# Altium schematic sheet 09 Ethernet.SchDoc: Ethernet
size 420 x 297 mm; SheetNumber: 9; SheetTotal: 11
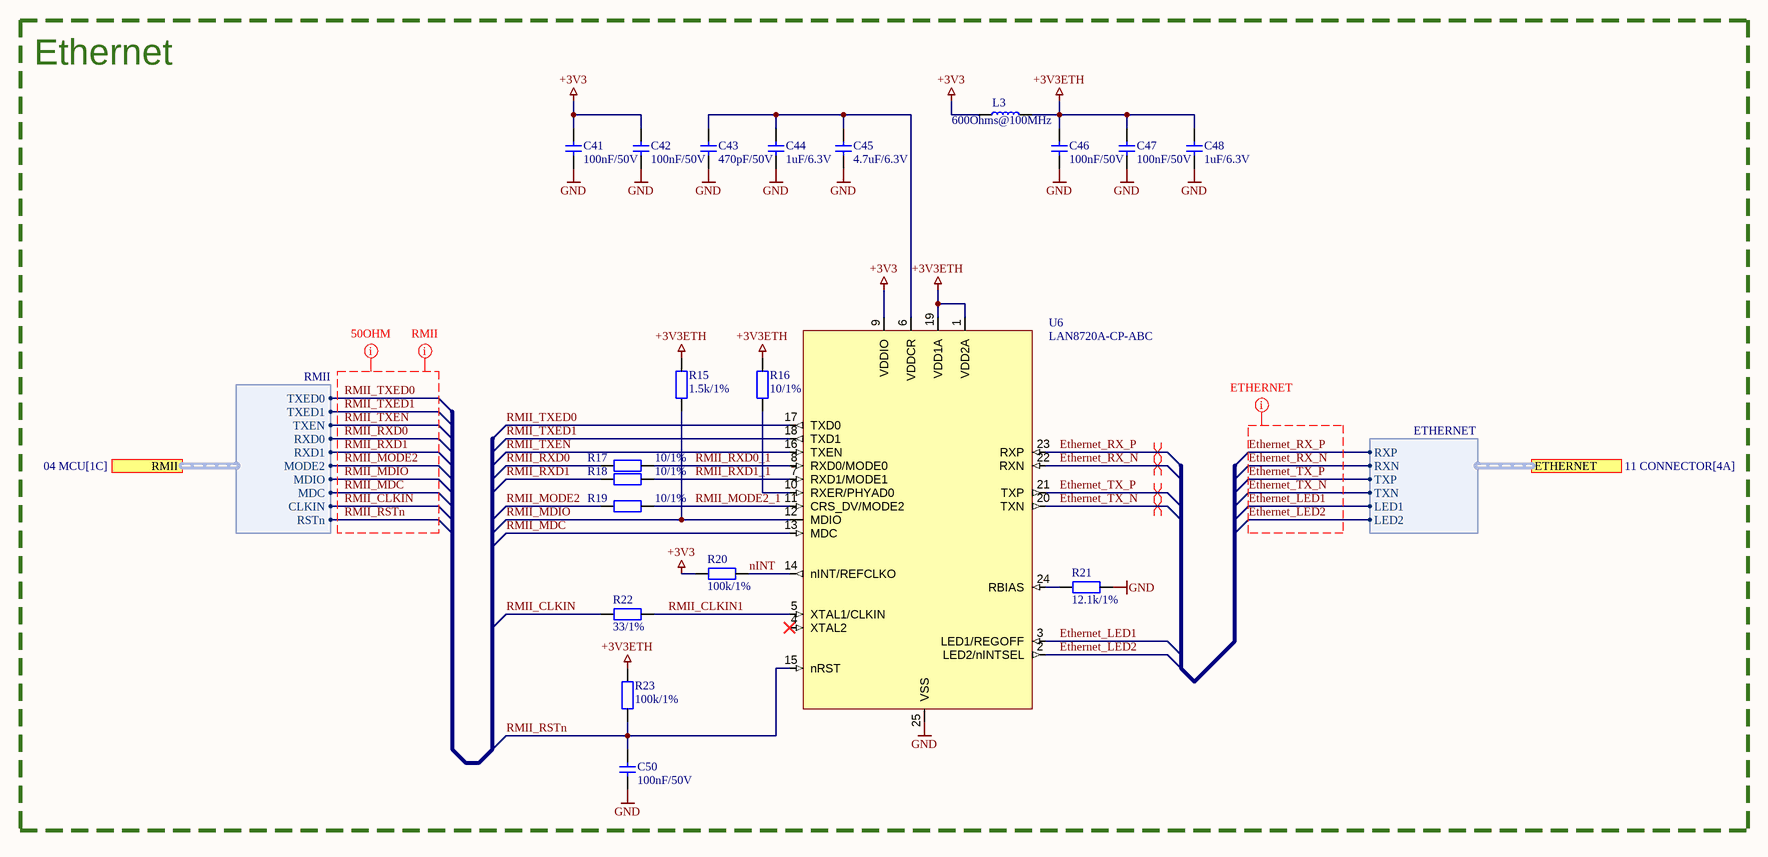
[diagram p0: 09 Ethernet.SchDoc]

## Parts
C41  100nF/50V  [CAPC1005X06M-0402]
C42  100nF/50V  [CAPC1005X06M-0402]
C43  470pF/50V  [CAPC1005X06M-0402]
C44  1uF/6.3V  [CAPC1005X06M-0402]
C45  4.7uF/6.3V  [CAPC1005X06M-0402]
C46  100nF/50V  [CAPC1005X06M-0402]
C47  100nF/50V  [CAPC1005X06M-0402]
C48  1uF/6.3V  [CAPC1005X06M-0402]
C50  100nF/50V  [CAPC1005X06M-0402]
L3  600Ohms@100MHz  [INDC1005X06M-0402]
R15  1.5k/1%  [RESC1005X04M-0402]
R16  10/1%  [RESC1005X04M-0402]
R17  10/1%  [RESC1005X04M-0402]
R18  10/1%  [RESC1005X04M-0402]
R19  10/1%  [RESC1005X04M-0402]
R20  100k/1%  [RESC1005X04M-0402]
R21  12.1k/1%  [RESC1005X04M-0402]
R22  33/1%  [RESC1005X04M-0402]
R23  100k/1%  [RESC1005X04M-0402]
U6  LAN8720A-CP-ABC  [QFN24P50_40X40X85L40X25]

## Blocks framed on the sheet
Ethernet: C41-C48 C50 L3 R15-R23 U6

## Ports
ETHERNET (harness ETHERNET, see 11 CONNECTOR[4A]), RMII (harness RMII, see 04 MCU[1C])

## Harnesses
ETHERNET: RXP, RXN, TXP, TXN, LED1, LED2
RMII: TXED0, TXED1, TXEN, RXD0, RXD1, MODE2, MDIO, MDC, CLKIN, RSTn

## Nets
+3V3: C41.2 C42.2 L3.1 R20.1 U6.9(VDDIO)
+3V3ETH: C46.2 C47.2 C48.2 L3.2 R15.2 R16.2 R23.1 U6.1(VDD2A) U6.19(VDD1A)
GND: C41.1 C42.1 C43.1 C44.1 C45.1 C46.1 C47.1 C48.1 C50.1 R21.2 U6.25(VSS)
Ethernet_LED1: U6.3(LED1/REGOFF) ; port ETHERNET.LED1
Ethernet_LED2: U6.2(LED2/nINTSEL) ; port ETHERNET.LED2
Ethernet_RX_N: U6.22(RXN) ; port ETHERNET.RXN
Ethernet_RX_P: U6.23(RXP) ; port ETHERNET.RXP
Ethernet_TX_N: U6.20(TXN) ; port ETHERNET.TXN
Ethernet_TX_P: U6.21(TXP) ; port ETHERNET.TXP
nINT: R20.2 U6.14(nINT/REFCLKO)
RMII_CLKIN: R22.1 ; port RMII.CLKIN
RMII_CLKIN1: R22.2 U6.5(XTAL1/CLKIN)
RMII_MDC: U6.13(MDC) ; port RMII.MDC
RMII_MDIO: R15.1 U6.12(MDIO) ; port RMII.MDIO
RMII_MODE2: R19.1 ; port RMII.MODE2
RMII_MODE2_1: R19.2 U6.11(CRS_DV/MODE2)
RMII_RSTn: C50.2 R23.2 U6.15(nRST) ; port RMII.RSTn
RMII_RXD0: R17.1 ; port RMII.RXD0
RMII_RXD0_1: R17.2 U6.8(RXD0/MODE0)
RMII_RXD1: R18.1 ; port RMII.RXD1
RMII_RXD1_1: R18.2 U6.7(RXD1/MODE1)
RMII_TXED0: U6.17(TXD0) ; port RMII.TXED0
RMII_TXED1: U6.18(TXD1) ; port RMII.TXED1
RMII_TXEN: U6.16(TXEN) ; port RMII.TXEN
NetC43_2: C43.2 C44.2 C45.2 U6.6(VDDCR)
NetR16_1: R16.1 U6.10(RXER/PHYAD0)
NetR21_1: R21.1 U6.24(RBIAS)

Not connected (* = marked no-connect by the designer): U6 4(XTAL2)*

## Layout directives
net class RMII: RMII_CLKIN, RMII_MDC, RMII_MDIO, RMII_MODE2, RMII_RSTn, RMII_RXD0, RMII_RXD1, RMII_TXED0, RMII_TXED1, RMII_TXEN
net class 50OHM: RMII_CLKIN, RMII_MDC, RMII_MDIO, RMII_MODE2, RMII_RSTn, RMII_RXD0, RMII_RXD1, RMII_TXED0, RMII_TXED1, RMII_TXEN
differential pair; differential pair class ETH_RX: Ethernet_RX_N, Ethernet_RX_P
differential pair; differential pair class ETH_TX: Ethernet_TX_N, Ethernet_TX_P
net class ETHERNET: Ethernet_LED1, Ethernet_LED2, Ethernet_RX_N, Ethernet_RX_P, Ethernet_TX_N, Ethernet_TX_P

## Notes on the sheet
- Title
- Project
- Size
- Date
- Revision
- A3
- Designed By

## Library data of the parts
C41 C42 C46 C47 C50 = GRM155R71H104KE14D: 0.1 µF ±10% 50V Ceramic Capacitor X7R 0402 (1005 Metric); ComponentLink1Description: Datasheet; ComponentLink1URL: https://search.murata.co.jp/Ceramy/image/img/A01X/G101/ENG/GRM155R60J475ME47-01.pdf; MPN: GRM155R71H104KE14D
C43 = GRM155R71H471KA01D: 470 pF ±10% 50V Ceramic Capacitor X7R 0402 (1005 Metric); ComponentLink1Description: Datasheet; ComponentLink1URL: https://search.murata.co.jp/Ceramy/image/img/A01X/G101/ENG/GRM155R60J475ME47-01.pdf; MPN: GRM155R71H471KA01D
C44 C48 = GRM155R70J105KA12J: 1 µF ±10% 6.3V Ceramic Capacitor X7R 0402 (1005 Metric); ComponentLink1Description: Datasheet; ComponentLink1URL: https://search.murata.co.jp/Ceramy/image/img/A01X/G101/ENG/GRM155R60J475ME47-01.pdf; MPN: GRM155R70J105KA12J
C45 = GRM155R60J475ME47D: 4.7 µF ±20% 6.3V Ceramic Capacitor X5R 0402 (1005 Metric); ComponentLink1Description: Datasheet; ComponentLink1URL: https://search.murata.co.jp/Ceramy/image/img/A01X/G101/ENG/GRM155R60J475ME47-01.pdf; MPN: GRM155R60J475ME47D
L3 = BLM15AG601SN1D: 600 Ohms @ 100 MHz 1 Ferrite Bead 0402 (1005 Metric) 300mA 520mOhm; ComponentLink1Description: Datasheet; ComponentLink1URL: https://www.murata.com/en-us/products/productdata/8796740059166/ENFA0018.pdf; MPN: BLM15AG601SN1D
R15 = RC0402FR-071K5L: 1.5 kOhms ±1% 0.063W, 1/16W Chip Resistor 0402 (1005 Metric) Moisture Resistant Thick Film; ComponentLink1Description: Datasheet; ComponentLink1URL: https://www.yageo.com/upload/media/product/productsearch/datasheet/rchip/PYu-RC_Group_51_RoHS_L_12.pdf; MPN: RC0402FR-071K5L
R16-R19 = RC0402FR-0710RL: 10 Ohms ±1% 0.063W, 1/16W Chip Resistor 0402 (1005 Metric) Moisture Resistant Thick Film; ComponentLink1Description: Datasheet; ComponentLink1URL: https://www.yageo.com/upload/media/product/productsearch/datasheet/rchip/PYu-RC_Group_51_RoHS_L_12.pdf; MPN: RC0402FR-0710RL
R20 R23 = RC0402FR-07100KL: 100 kOhms ±1% 0.063W, 1/16W Chip Resistor 0402 (1005 Metric) Moisture Resistant Thick Film; ComponentLink1Description: Datasheet; ComponentLink1URL: https://www.yageo.com/upload/media/product/productsearch/datasheet/rchip/PYu-RC_Group_51_RoHS_L_12.pdf; MPN: RC0402FR-07100KL
R21 = RC0402FR-0712K1L: 12.1 kOhms ±1% 0.063W, 1/16W Chip Resistor 0402 (1005 Metric) Moisture Resistant Thick Film; ComponentLink1Description: Datasheet; ComponentLink1URL: https://www.yageo.com/upload/media/product/productsearch/datasheet/rchip/PYu-RC_Group_51_RoHS_L_12.pdf; MPN: RC0402FR-0712K1L
R22 = RC0402FR-0733RL: 33 Ohms ±1% 0.063W, 1/16W Chip Resistor 0402 (1005 Metric) Moisture Resistant Thick Film; ComponentLink1Description: Datasheet; ComponentLink1URL: https://www.yageo.com/upload/media/product/productsearch/datasheet/rchip/PYu-RC_Group_51_RoHS_L_12.pdf; MPN: RC0402FR-0733RL
U6 = LAN8720A: 2/2 Transceiver Full RMII 24-SQFN (4x4); MPN: LAN8720A-CP-ABC; ComponentLink1Description: Datasheet; ComponentLink1URL: https://ww1.microchip.com/downloads/aemDocuments/documents/OTH/ProductDocuments/DataSheets/00002165B.pdf